# Altium schematic sheet POL&JFET.SchDoc
size A2
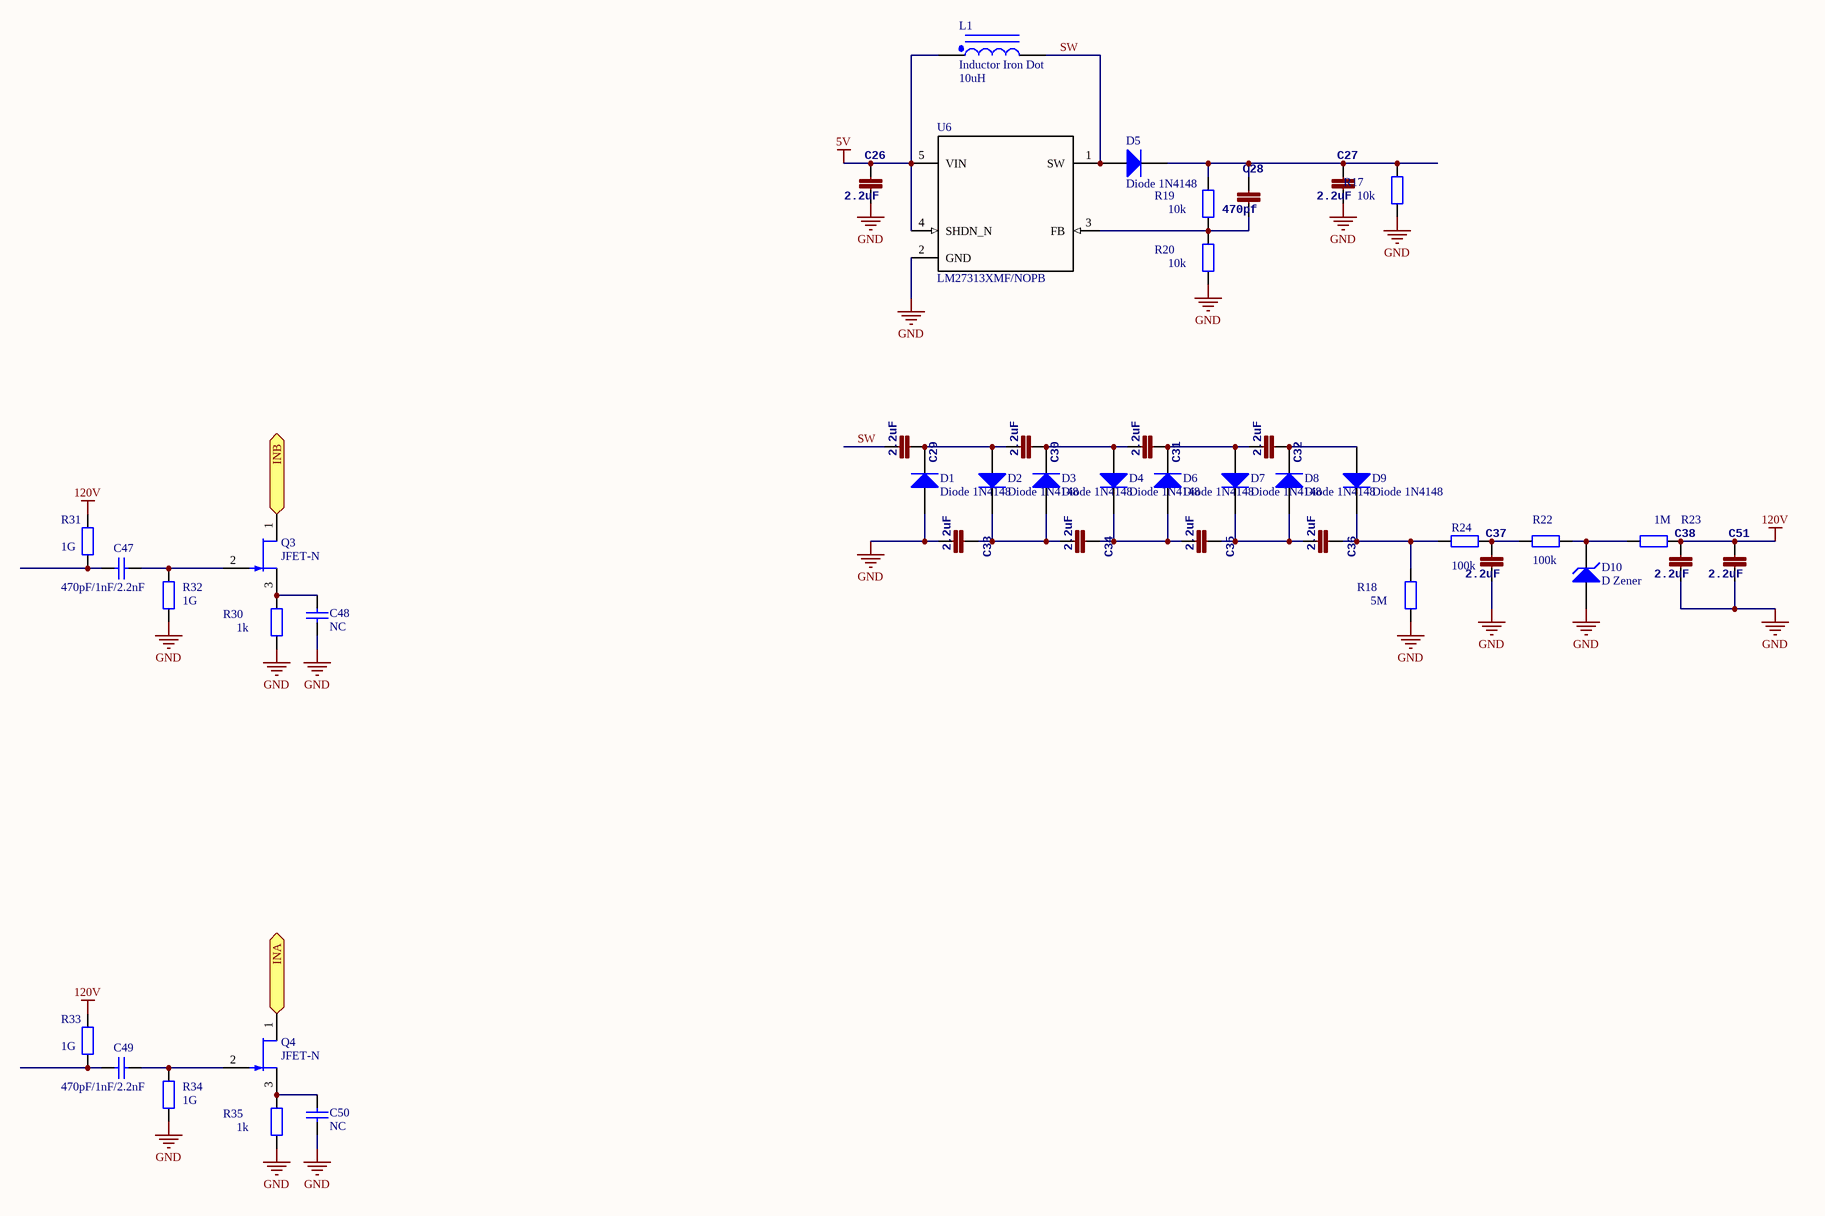
[diagram p0: POL&JFET.SchDoc]

## Parts
C26  2.2uF  [0805]
C27  2.2uF  [0805]
C28  470pf  [0402]
C29  2.2uF  [0805]
C30  2.2uF  [0805]
C31  2.2uF  [0805]
C32  2.2uF  [0805]
C33  2.2uF  [0805]
C34  2.2uF  [0805]
C35  2.2uF  [0805]
C36  2.2uF  [0805]
C37  2.2uF  [0805]
C38  2.2uF  [0805]
C47  470pF/1nF/2.2nF  [CL21-5mm-1A]
C48  NC  [0402]
C49  470pF/1nF/2.2nF  [CL21-5mm-1A]
C50  NC  [0402]
C51  2.2uF  [0805]
D1  Diode 1N4148  [LC-SOD-323]
D2  Diode 1N4148  [LC-SOD-323]
D3  Diode 1N4148  [LC-SOD-323]
D4  Diode 1N4148  [LC-SOD-323]
D5  Diode 1N4148  [LC-SOD-323]
D6  Diode 1N4148  [LC-SOD-323]
D7  Diode 1N4148  [LC-SOD-323]
D8  Diode 1N4148  [LC-SOD-323]
D9  Diode 1N4148  [LC-SOD-323]
D10  D Zener  [SMA]
L1  Inductor Iron Dot  value 10uH  [L4015]
Q3  JFET-N  [TO-92]
Q4  JFET-N  [TO-92]
R17  value 10k  [0402]
R18  value 5M  [0402]
R19  value 10k  [0402]
R20  value 10k  [0402]
R22  value 100k  [0402]
R23  value 1M  [0402]
R24  value 100k  [0402]
R30  value 1k  [0402]
R31  value 1G  [R-1G]
R32  value 1G  [R-1G]
R33  value 1G  [R-1G]
R34  value 1G  [R-1G]
R35  value 1k  [0402]
U6  LM27313XMF/NOPB  [SOT23-5]

## Ports
INA, INB

## Nets
5V: C26.2 L1.1 U6.4(SHDN_N) U6.5(VIN)
120V: C38.2 C51.2 R23.1 R31.2 R33.2
GND: C26.1 C27.1 C33.1 C37.1 C38.1 C48.2 C50.2 C51.1 D1.1(A) D10.1(A) R17.1 R18.1 R20.1 R30.1 R32.1 R34.1 R35.1 U6.2(GND)
INA: Q4.1(D) ; port INA
INB: Q3.1(D) ; port INB
SW: C29.1 D5.1(A) L1.2 U6.1(SW)
NetC27_2: C27.2 C28.2 D5.2(K) R17.2 R19.2
NetC28_1: C28.1 R19.1 R20.2 U6.3(FB)
NetC29_2: C29.2 C30.1 D1.2(K) D2.1(A)
NetC30_2: C30.2 C31.1 D3.2(K) D4.1(A)
NetC31_2: C31.2 C32.1 D6.2(K) D7.1(A)
NetC32_2: C32.2 D8.2(K) D9.1(A)
NetC33_2: C33.2 C34.1 D2.2(K) D3.1(A)
NetC34_2: C34.2 C35.1 D4.2(K) D6.1(A)
NetC35_2: C35.2 C36.1 D7.2(K) D8.1(A)
NetC36_2: C36.2 D9.2(K) R18.2 R24.2
NetC37_2: C37.2 R22.2 R24.1
NetC47_1: C47.1 R31.1
NetC47_2: C47.2 Q3.2(G) R32.2
NetC48_1: C48.1 Q3.3(S) R30.2
NetC49_1: C49.1 R33.1
NetC49_2: C49.2 Q4.2(G) R34.2
NetC50_1: C50.1 Q4.3(S) R35.2
NetD10_2: D10.2(K) R22.1 R23.2

## Library data of the parts
C26-C38 C51 = CAP0402-CAP: <b>Capacitor</b> / Standard 0603 ceramic capacitor, and 0.1" leaded capacitor.; PARTNO: CC0402ZRY5V7BB104
C47-C50 = Cap: Capacitor; Published: 8-Jun-2000; LatestRevisionDate: 17-Jul-2002; LatestRevisionNote: Re-released for DXP Platform.; PackageReference: RAD-0.3; Publisher: Altium Limited; PackageDescription: Radial Cap, Thru-Hole; 2 Leads; 0.3 in Pin Spacing
D1-D9 = Diode 1N4148: High Conductance Fast Diode; Published: 8-Jun-2000; LatestRevisionDate: 17-Jul-2002; LatestRevisionNote: Re-released for DXP Platform.; DatasheetVersion: 1997; PackageReference: DO-35; Publisher: Altium Limited; PackageDescription: Diode, Axial; Body 3.8 x 1.9 mm (LxDia. max), Lead Dia. 0.53 mm (max); Code_JEDEC: DO-204-AH; ComponentLink1Description: Manufacturer Link; ComponentLink1URL: http://www.fairchildsemi.com/; ComponentLink2Description: Datasheet; ComponentLink2URL: http://www.fairchildsemi.com/ds/1N%2F1N4148.pdf
D10 = D Zener: Zener Diode; Published: 8-Jun-2000; LatestRevisionDate: 17-Jul-2002; LatestRevisionNote: Re-released for DXP Platform.; PackageReference: DIODE-0.7; Publisher: Altium Limited; PackageDescription: Diode, Thru-Hole; 2 Leads; 0.7 in Pin Spacing
L1 = Inductor Iron Dot: Magnetic-Core Inductor with Winding Polarity Marking; Published: 24-Mar-1999; LatestRevisionDate: 17-Jul-2002; LatestRevisionNote: Re-released for DXP Platform.; PackageReference: DIODE_SMC; Publisher: Altium Limited; PackageDescription: Diode; 2 Leads
Q3 Q4 = JFET-N: N-Channel JFET; Published: 8-Jun-2000; LatestRevisionDate: 17-Jul-2002; LatestRevisionNote: Re-released for DXP Platform.; PackageReference: TO-254-AA; Publisher: Altium Limited; Code_JEDEC: TO-254-AA
R17-R20 R22-R24 R30-R35 = Res2: Resistor; Published: 8-Jun-2000; LatestRevisionDate: 17-Jul-2002; LatestRevisionNote: Re-released for DXP Platform.; PackageReference: AXIAL-0.4; Publisher: Altium Limited; PackageDescription: Axial Device, Thru-Hole; 2 Leads; 0.4 in Pin Spacing
U6 = LM27313XMF/NOPB: Imported; Manufacturer: Texas Instruments; CompType: IC; PIN_COUNT: 5; PartNumber: LM27313XMF/NOPB; PackageReference: DBV0005A; MountType: SMT; RoHS: Y; RefDes: RefDes; Type: DEV; Value: Value